# EAGLE design branches_v40 (EAGLE 9.6.2)
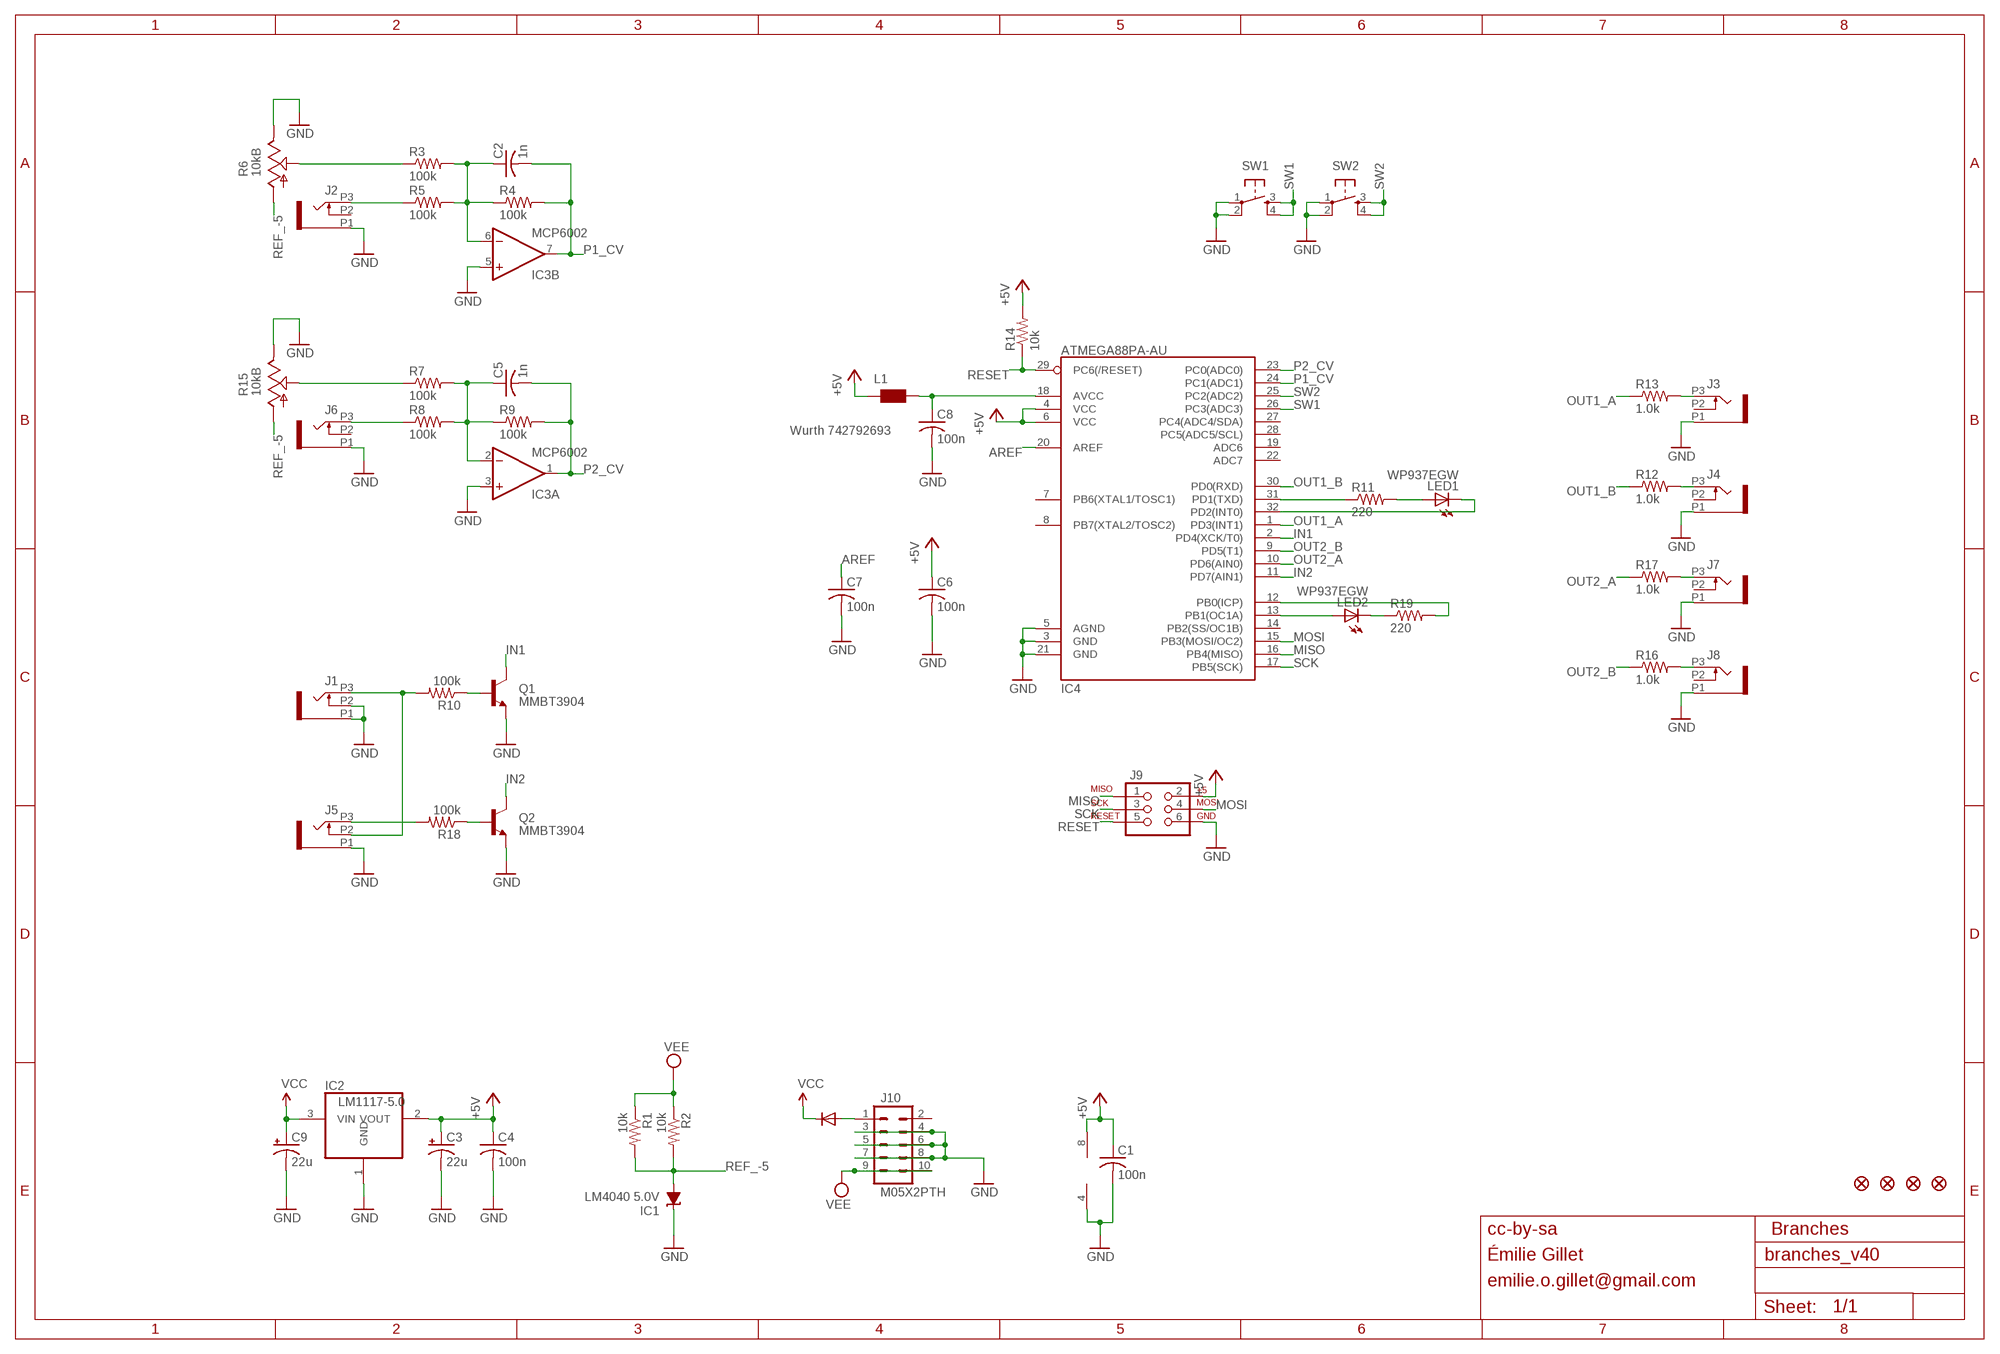
[diagram p0: schematic, sheet 1]

## Parts
C1  100n  C-USC0603  [C0603]
C2  1n  C-USC0603  [C0603]
C3  22u  CPOL-USC  [PANASONIC_C]
C4  100n  C-USC0603  [C0603]
C5  1n  C-USC0603  [C0603]
C6  100n  C-USC0603  [C0603]
C7  100n  C-USC0603  [C0603]
C8  100n  C-USC0603  [C0603]
C9  22u  CPOL-USC  [PANASONIC_C]
D1  1N5819HW  DIODE-SOD123  [SOD123]
F1  FIDUCIAL1X2  [FIDUCIAL-1X2]
F2  FIDUCIAL1X2  [FIDUCIAL-1X2]
F3  FIDUCIAL1X2  [FIDUCIAL-1X2]
F4  FIDUCIAL1X2  [FIDUCIAL-1X2]
IC1  LM4040 5.0V  LM4041C12DBZ  [DBZ_R-PDSO-G3]
IC2  LM1117-5.0  REG1117  [SOT223]
IC3  MCP6002  TL072D  [SO08]
IC4  ATMEGA88PA-AU  ATMEGA168  [TQFP32-08]
J1  PJ301_THONKICONN6  [WQP_PJ_301M6]
J2  PJ301_THONKICONN6  [WQP_PJ_301M6]
J3  PJ301_THONKICONN6  [WQP_PJ_301M6]
J4  PJ301_THONKICONN6  [WQP_PJ_301M6]
J5  PJ301_THONKICONN6  [WQP_PJ_301M6]
J6  PJ301_THONKICONN6  [WQP_PJ_301M6]
J7  PJ301_THONKICONN6  [WQP_PJ_301M6]
J8  PJ301_THONKICONN6  [WQP_PJ_301M6]
J9  AVR_SPI_PRG_6PTH  [2X3]
J10  M05X2PTH  [AVR_ICSP]
L1  WE-CBF_0603  [0603]
LED1  WP937EGW  LED3MM  [LED3MM]
LED2  WP937EGW  LED3MM  [LED3MM]
Q1  MMBT3904  MMBT3904LT1-NPN-SOT23-BEC  [SOT23-BEC]
Q2  MMBT3904  MMBT3904LT1-NPN-SOT23-BEC  [SOT23-BEC]
R1  10k  R-US_R0603  [R0603]
R2  10k  R-US_R0603  [R0603]
R3  100k  R-US_R0603  [R0603]
R4  100k  R-US_R0603  [R0603]
R5  100k  R-US_R0603  [R0603]
R6  10kB  POT_USVERTICAL_PS  [ALPS_POT_VERTICAL_PS]
R7  100k  R-US_R0603  [R0603]
R8  100k  R-US_R0603  [R0603]
R9  100k  R-US_R0603  [R0603]
R10  100k  R-US_R0603  [R0603]
R11  220  R-US_R0603  [R0603]
R12  1.0k  R-US_R0603  [R0603]
R13  1.0k  R-US_R0603  [R0603]
R14  10k  R-US_R0603  [R0603]
R15  10kB  POT_USVERTICAL_PS  [ALPS_POT_VERTICAL_PS]
R16  1.0k  R-US_R0603  [R0603]
R17  1.0k  R-US_R0603  [R0603]
R18  100k  R-US_R0603  [R0603]
R19  220  R-US_R0603  [R0603]
SW1  TAC_SWITCHPTH  [TACTILE-PTH]
SW2  TAC_SWITCHPTH  [TACTILE-PTH]

## Nets
+5V: C1.1 C3.+ C4.1 C6.1 IC2.2(VOUT) IC3.8(P:V+) IC4.4(VCC) IC4.6(VCC) J9.2 L1.1 R14.2
AREF: C7.1 IC4.20(AREF)
GATE1_IN: J1.P3 J5.P2 R10.2
GATE2_IN: J5.P3 R18.2
GND: C1.2 C3.- C4.2 C6.2 C7.2 C8.2 C9.- IC1.1(C) IC2.1(GND) IC3.3(A:+IN) IC3.4(P:V-) IC3.5(B:+IN) IC4.3(GND) IC4.5(AGND) IC4.21(GND) J1.P1 J1.P2 J2.P1 J3.P1 J4.P1 J5.P1 J6.P1 J7.P1 J8.P1 J9.6 J10.3 J10.4 J10.5 J10.6 J10.7 J10.8 Q1.E Q2.E R6.P$1(E) R15.P$1(E) SW1.1 SW1.2 SW2.1 SW2.2
IN1: IC4.2(PD4(XCK/T0)) Q1.C
IN2: IC4.11(PD7(AIN1)) Q2.C
MISO: IC4.16(PB4(MISO)) J9.1
MOSI: IC4.15(PB3(MOSI/OC2)) J9.4
N$1: Q1.B R10.1
N$2: Q2.B R18.1
N$3: D1.A J10.1
N$4: C5.1 IC3.2(A:-IN) R7.2 R8.2 R9.1
N$6: J8.P3 R16.2
N$8: R7.1 R15.P$2(S)
N$9: R3.1 R6.P$2(S)
N$10: J2.P3 R5.1
N$11: J6.P3 R8.1
N$13: IC4.31(PD1(TXD)) R11.1
N$14: LED1.A R11.2
N$15: IC4.32(PD2(INT0)) LED1.K(C)
N$16: IC4.13(PB1(OC1A)) LED2.A
N$17: LED2.K(C) R19.1
N$18: IC4.12(PB0(ICP)) R19.2
N$29: C2.1 IC3.6(B:-IN) R3.2 R4.1 R5.2
N$34: J3.P3 R13.2
N$35: J4.P3 R12.2
N$36: J7.P3 R17.2
N$39: C8.1 IC4.18(AVCC) L1.2
OUT1_A: IC4.1(PD3(INT1)) R13.1
OUT1_B: IC4.30(PD0(RXD)) R12.1
OUT2_A: IC4.10(PD6(AIN0)) R17.1
OUT2_B: IC4.9(PD5(T1)) R16.1
P1_CV: C2.2 IC3.7(B:OUT) IC4.24(PC1(ADC1)) R4.2
P2_CV: C5.2 IC3.1(A:OUT) IC4.23(PC0(ADC0)) R9.2
REF_-5: IC1.2(A) R1.2 R2.2 R6.P$3(A) R15.P$3(A)
RESET: IC4.29(PC6(/RESET)) J9.5 R14.1
SCK: IC4.17(PB5(SCK)) J9.3
SW1: IC4.26(PC3(ADC3)) SW1.3 SW1.4
SW2: IC4.25(PC2(ADC2)) SW2.3 SW2.4
VCC: C9.+ D1.C IC2.3(VIN)
VEE: J10.9 J10.10 R1.1 R2.1
Unconnected: IC4.7(PB6(XTAL1/TOSC1)) IC4.8(PB7(XTAL2/TOSC2)) IC4.14(PB2(SS/OC1B)) IC4.19(ADC6) IC4.22(ADC7) IC4.27(PC4(ADC4/SDA)) IC4.28(PC5(ADC5/SCL)) J2.P2 J3.P2 J4.P2 J6.P2 J7.P2 J8.P2 J10.2

## Notes on the sheet
- Wurth 742792693
- cc-by-sa | Branches
- Émilie Gillet
- emilie.o.gillet@gmail.com

## Library data of the parts
C1 C2 C4-C8 = rcl:C-US: CAPACITOR, American symbol
C3 C9 = rcl:CPOL-US: POLARIZED CAPACITOR, American symbol
D1 = diode:DIODE-: DIODE
F1-F4 = SparkFun:FIDUCIAL: Fiducial Alignment Points Various fiducial points for machine vision alignment.
IC1 = texas:LM4041: PRECISION MICROPOWER SHUNT VOLTAGE REFERENCE Source: http://focus.ti.com/lit/ds/slcs146e/slcs146e.pdf
IC2 = og-vreg:REG1117: 800mA and 1A Low Dropout (LDO) Positive Regulator 1.8V, 2.5V, 2.85V, 3.3V, 5V, and Adj
IC3 = og-linear:TL072: OP AMP
IC4 = SparkFun:ATMEGA168
J1-J8 = og-pj301:PJ301_THONKICONN
J9 = SparkFun:AVR_SPI_PRG_6: AVR ISP 6 Pin This is the reduced ISP connector for AVR programming. Common on Arduino. This footprint will take up less PCB space and can be used with a 10-pin to 6-pin adapter such as SKU: BOB-08508
J10 = og-header:M05X2: Header 5x2 Standard 10-pin dual row 0.1" header. Commonly used with AVR-ISP. Use with Spark Fun Electronics SKU: PRT-00778
L1 = wuerth-elektronik:WE-CBF: SMD EMI Suppression Ferrite Beads - excellent anti-EMI properties - low DCR - impedances till 3000 ohms - rated current up to 6 A
LED1 LED2 = led:LED: LED OSRAM: - CHIPLED LG R971, LG N971, LY N971, LG Q971, LY Q971, LO R971, LY R971 LH N974, LH R974 LS Q976, LO Q976, LY Q976 LO Q996 - Hyper CHIPLED LW Q18S LB Q993, LB Q99A, LB R99A - SideLED LS A670, LO A670, LY A670, LG A670, LP A670 LB A673, LV A673, LT A673, LW A673 LH A674 LY A675 LS A676, LA A676, LO A676, LY A676, LW A676 LS A679, LY A679, LG A679 - Hyper Micro SIDELED® LS Y876, LA Y876, LO Y876, LY Y876 LT Y87S - SmartLED LW L88C, LW L88S LB L89C, LB L89S, LG L890 LS L89K, LO L89K, LY L89K LS L896, LA L896, LO L896, LY L896 - TOPLED LS T670, LO T670, LY T670, LG T670, LP T670 LSG T670, LSP T670, LSY T670, LOP T670, LYG T670 LG T671, LOG T671, LSG T671 LB T673, LV T673, LT T673, LW T673 LH T674 LS T676, LA T676, LO T676, LY T676, LB T676, LH T676, LSB T676, LW T676 LB T67C, LV T67C, LT T67C, LS T67K, LO T67K, LY T67K, LW E67C LS E67B, LA E67B, LO E67B, LY E67B, LB E67C, LV E67C, LT E67C LW T67C LS T679, LY T679, LG T679 LS T770, LO T770, LY T770, LG T770, LP T770 LB T773, LV T773, LT T773, LW T773 LH T774 LS E675, LA E675, LY E675, LS T675 LS T776, LA T776, LO T776, LY T776, LB T776 LHGB T686 LT T68C, LB T68C - Hyper Mini TOPLED® LB M676 - Mini TOPLED Santana® LG M470 LS M47K, LO M47K, LY M47K Source: http://www.osram.convergy.de LUXEON: - LUMILED® LXK2-PW12-R00, LXK2-PW12-S00, LXK2-PW14-U00, LXK2-PW14-V00 LXK2-PM12-R00, LXK2-PM12-S00, LXK2-PM14-U00 LXK2-PE12-Q00, LXK2-PE12-R00, LXK2-PE12-S00, LXK2-PE14-T00, LXK2-PE14-U00 LXK2-PB12-K00, LXK2-PB12-L00, LXK2-PB12-M00, LXK2-PB14-N00, LXK2-PB14-P00, LXK2-PB14-Q00 LXK2-PR12-L00, LXK2-PR12-M00, LXK2-PR14-Q00, LXK2-PR14-R00 LXK2-PD12-Q00, LXK2-PD12-R00, LXK2-PD12-S00 LXK2-PH12-R00, LXK2-PH12-S00 LXK2-PL12-P00, LXK2-PL12-Q00, LXK2-PL12-R00 Source: www.luxeon.com KINGBRIGHT: KA-3528ASYC Source: www.kingbright.com
Q1 Q2 = transistor:*-NPN-: NPN Transistror BF959 corrected 2008.03.06
R1 R2 = resistor:R-US_: RESISTOR, American symbol
R3-R5 R7-R14 R16-R19 = rcl:R-US_: RESISTOR, American symbol
R6 R15 = pot-alps:POT_US
SW1 SW2 = SparkFun:TAC_SWITCH: Momentary Switch Button commonly used for reset or general input. Spark Fun Electronics SKU : COM-00097

## Board
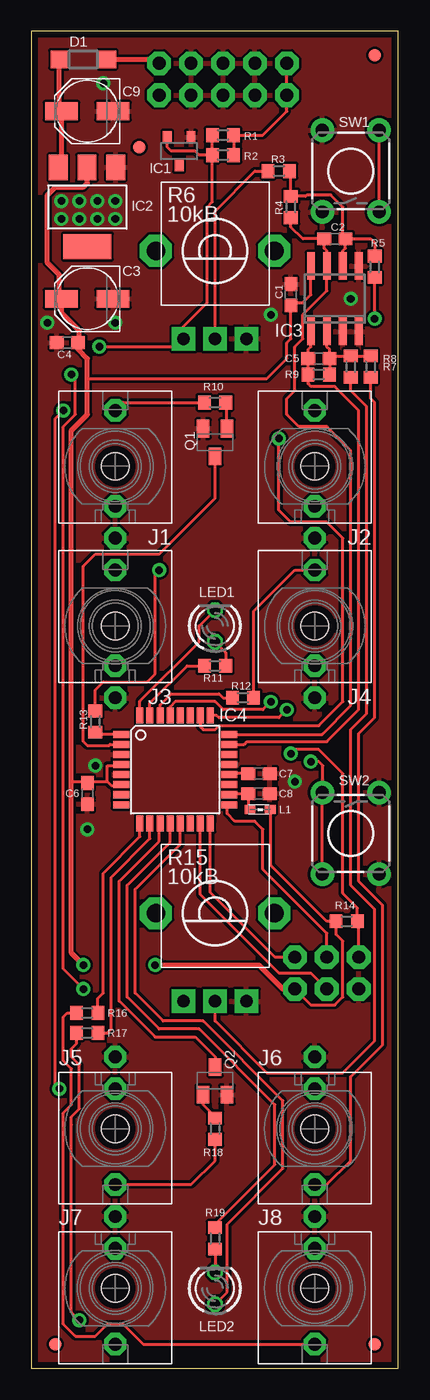
[diagram p1: board, top side]
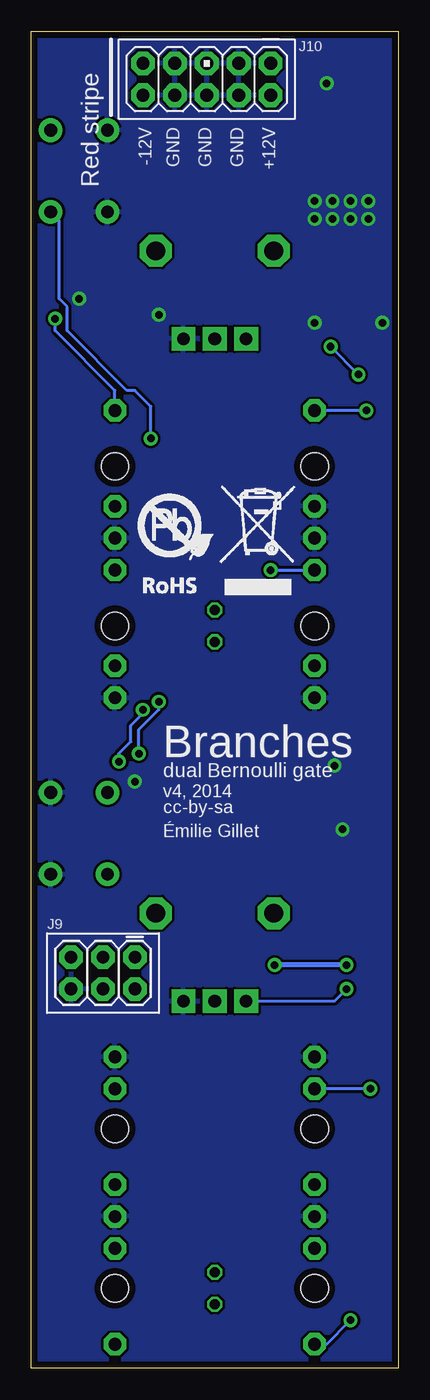
[diagram p2: board, bottom side, seen from below]

Size 29.19 x 106.36 mm. Coordinates in mm from the lower left corner, seen from the top.
Outline: 0,0 29.19,0 29.19,106.36 0,106.36 0,0
Copper layers (1*16): Top 0.035mm / dielectric 1.5mm / Bottom 0.035mm
Design rules "PCBCart-Standard *": minimum track width 8mil, minimum drill 0.4mm, track to track 8mil, track to pad 8mil, pad to pad 8mil, via to via 8mil, smd to smd 8mil, copper to edge 20mil, drill to drill 8mil, minimum pad ring 8mil, minimum via ring 10mil, stop-mask expansion 3mil, vias tented up to drill 25mil, thermal gap 8mil

### Footprints (pad centres in the part's own frame; a part is rotated, then mirrored left to right if it is on the bottom)
C0603 = smd 1.1 x 1: 1 -0.85,0; 2 0.85,0
PANASONIC_C = smd 2.6 x 1.4: + 2.05,0; - -2.05,0
SOD123 = smd 1.4 x 1.4: A 1.9,0; C -1.9,0
FIDUCIAL-1X2 = smd 1 x 1: 1 0,0
DBZ_R-PDSO-G3 = smd 0.7 x 1: 1 -0.95,-1.1; 2 0.95,-1.1; 3 0,1.1
SOT223 = smd 1.499 x 2.007: 1 -2.261,-3.15; 2 0.025,-3.15; 3 2.311,-3.15 | smd 3.81 x 2.007: 4 0,3.15
SO08 = smd 0.6 x 2.2: 1 -1.905,-2.6; 2 -0.635,-2.6; 3 0.635,-2.6; 4 1.905,-2.6; 5 1.905,2.6; 6 0.635,2.6; 7 -0.635,2.6; 8 -1.905,2.6
TQFP32-08 = smd 1.27 x 0.559: 1 -4.293,2.8; 2 -4.293,2; 3 -4.293,1.2; 4 -4.293,0.4; 5 -4.293,-0.4; 6 -4.293,-1.2; 7 -4.293,-2; 8 -4.293,-2.8; 17 4.293,-2.8; 18 4.293,-2; 19 4.293,-1.2; 20 4.293,-0.4; 21 4.293,0.4; 22 4.293,1.2; 23 4.293,2; 24 4.293,2.8 | smd 0.559 x 1.27: 9 -2.8,-4.293; 10 -2,-4.293; 11 -1.2,-4.293; 12 -0.4,-4.293; 13 0.4,-4.293; 14 1.2,-4.293; 15 2,-4.293; 16 2.8,-4.293; 25 2.8,4.293; 26 2,4.293; 27 1.2,4.293; 28 0.4,4.293; 29 -0.4,4.293; 30 -1.2,4.293; 31 -2,4.293; 32 -2.8,4.293
WQP_PJ_301M6 = drill 1.016 pad 1.778 octagon: P1 0,-5.715; P2 0,-3.175; P3 0,4.445 | hole 2.2: 0,0
2X3 = drill 1.016 pad 1.88 octagon: 1 0,0; 2 0,2.54; 3 2.54,0; 4 2.54,2.54; 5 5.08,0; 6 5.08,2.54
AVR_ICSP = drill 1.016 pad 1.88 octagon: 1 -1.27,5.08; 2 1.27,5.08; 3 -1.27,2.54; 4 1.27,2.54; 5 -1.27,0; 6 1.27,0; 7 -1.27,-2.54; 8 1.27,-2.54; 9 -1.27,-5.08; 10 1.27,-5.08
0603 = smd 0.85 x 0.7: 1 -0.9,0; 2 0.7,0
LED3MM = drill 0.813 octagon: A -1.27,0; K 1.27,0
SOT23-BEC = smd 1 x 1.4: B -0.95,-1.1; C 0,1.1; E 0.95,-1.1
R0603 = smd 1 x 1.1: 1 -0.85,0; 2 0.85,0
ALPS_POT_VERTICAL_PS = drill 1 pad 1.88 square: P$1 -2.5,7; P$2 0,7; P$3 2.5,7 | drill 1.5 pad 2.54 octagon: P$4 -4.7,0; P$5 4.7,0
TACTILE-PTH = drill 1.016 pad 1.88: 1 -3.251,2.261; 2 3.251,2.261; 3 -3.251,-2.261; 4 3.251,-2.261

### Placement (x,y rotation side)
C1  20.64,85.41 90 top
C2  24.13,89.85 180 top
C3  4.45,85.09 180 top
C4  2.86,81.6 180 top
C5  22.86,80.33 180 top
C6  4.45,45.72 270 top
C7  18.1,47.31 0 top
C8  18.1,45.72 0 top
C9  4.45,100.01 180 top
D1  4.13,104.14 0 top
F1  27.3,104.46 90 top
F2  8.57,97.16 90 top
F3  1.91,1.91 90 top
F4  27.3,1.91 90 top
IC1  11.75,96.84 180 top
IC2  4.45,92.39 180 top
IC3  24.13,85.09 0 top
IC4  11.43,47.62 0 top
J1  6.67,71.75 0 top
J2  22.54,71.75 0 top
J3  6.67,59.05 0 top
J4  22.54,59.05 0 top
J5  6.67,19.05 180 top
J6  22.54,19.05 180 top
J7  6.67,6.35 180 top
J8  22.54,6.35 180 top
J9  20.95,32.7 180 bottom
J10  15.24,102.55 270 bottom
L1  18.1,44.45 180 top
LED1  14.61,59.05 90 top
LED2  14.61,6.35 90 top
Q1  14.61,73.66 180 top
Q2  14.61,22.86 0 top
R1  15.24,98.11 180 top
R2  15.24,96.52 180 top
R3  19.68,95.25 0 top
R4  20.64,92.39 270 top
R5  27.3,87.63 90 top
R6  14.61,88.9 180 top
R7  25.4,79.69 90 top
R8  26.99,79.69 90 top
R9  22.86,79.06 180 top
R10  14.61,76.83 180 top
R11  14.61,55.88 0 top
R12  16.83,53.34 0 top
R13  5.08,51.44 90 top
R14  25.08,35.56 180 top
R15  14.61,36.2 180 top
R16  4.45,28.26 180 top
R17  4.45,26.67 180 top
R18  14.61,19.05 270 top
R19  14.61,10.32 90 top
SW1  25.4,95.25 90 top
SW2  25.4,42.55 270 top
U$1  [ROHS]  21.59,60.96 0 bottom

### Tracks (layer width: path | path; a pad name or v marks a point on that pad's centre or on a via)
+5V  (via drill 0.6)
  Top 0.254: IC4.4 7.05,47.94 6.03,47.94 6.03,46.67 | IC4.6 7.07,46.35 6.35,46.35 6.03,46.67 | 4.55,46.67 C6.1 | 3.17,46.67 4.55,46.67 | L1.1 19.05,44.4 19.05,40.01 23.5,35.56 R14.2 24.23,34.51 24.77,33.97 24.77,29.53 24.13,28.89 22.23,28.89 J9.2 | 4.45,78.74 18.73,78.74 20.32,80.33 20.32,81.6 20.64,81.92 C1.1 20.85,84.77 21.59,84.77 22.23,85.41 IC3.8 | 4.55,46.67 6.03,46.67
  Top 0.406: IC2.2 4.45,95.52 4.45,94.3 4.13,93.98 1.91,93.98 1.27,93.34 1.27,87.95 2.22,87 2.22,85.26 C3.+ | C3.+ 2.33,85.02 | v4.13,32.07 3.17,33.02 3.17,46.67 3.17,74.61 4.45,75.88 4.45,78.74 4.45,80.33 3.71,81.06 C4.1 3.81,81.7 3.81,82.55 2.4,83.97 C3.+ | v9.84,32.07 18.1,32.07 20,30.16 J9.2
  Bottom 0.406: v4.13,32.07 v9.84,32.07
AREF
  Top 0.254: IC4.20 15.8,47.31 C7.1
GATE1_IN  (via drill 0.6)
  Top 0.254: J1.P3 7.3,76.83 R10.2 | v2.54,76.2 1.91,75.56 1.91,22.54 v2.22,22.23
  Bottom 0.254: v2.54,76.2 J1.P3 | v2.22,22.23 J5.P2
GATE2_IN
  Top 0.254: 14.5,18.2 R18.2 14.61,16.51 12.7,14.61 J5.P3
GND  (via drill 0.6)
  other vias: 20.95,46.67 4.45,42.86 6.67,83.19 2.38,92.87 3.81,92.87 5.24,92.87 6.67,92.87 2.38,91.44 3.81,91.44 5.24,91.44 6.67,91.44 25.4,85.09 1.27,83.19 19.05,83.82 5.08,47.94 5.71,102.23
  pour Bottom: 0,106.36 0,0 29.21,0 29.21,106.36
  pour Top: 0,106.36 0,0 29.21,0 29.21,106.36
IN1
  Top 0.254: Q1.C 14.61,69.22 10.16,64.77 5.08,64.77 4.13,63.82 4.13,49.85 4.45,49.53 6.16,49.53 6.25,49.62 IC4.2
IN2
  Top 0.254: IC4.11 10.16,43.26 10.16,41.91 6.99,38.73 6.99,29.21 9.84,26.35 13.02,26.35 14.61,24.77 Q2.C
MISO
  Top 0.254: 14.39,43.5 IC4.16 14.23,37.84 19.37,32.7 J9.1
MOSI
  Top 0.254: 13.34,43.24 IC4.15 13.43,37.69 19.68,31.43 22.23,31.43 J9.4
N$1
  Top 0.254: R10.1 15.55,76.73 Q1.B
N$2
  Top 0.254: Q2.B 13.65,20.95 14.61,20 R18.1
N$3
  Top 0.406: J10.1 9.84,104.14 D1.A
N$4
  Top 0.254: C5.1 R9.1 | C5.1 23.93,80.54 R7.2 R8.2 | IC3.2 23.5,81.28 23.71,81.06 C5.1
N$6
  Top 0.254: R16.2 2.86,28.26 2.54,27.94 2.54,24.45 3.17,23.81 3.17,20.95 2.54,20.32 2.54,3.49 3.49,2.54 5.08,2.54 6.03,3.49 7.3,3.49 8.89,1.91 J8.P3
N$8
  Top 0.254: R15.P$2 14.61,27.62 18.73,23.5 24.77,23.5 27.3,26.04 27.3,36.51 25.4,38.42 25.4,50.8 26.67,52.07 26.67,76.52 25.4,77.79 R7.1
N$9
  Top 0.254: R6.P$2 14.61,92.08 17.78,95.25 R3.1
N$10  (via drill 0.6)
  Top 0.254: v27.3,83.5 R5.1
  Bottom 0.254: v27.3,83.5 27.3,82.55 22.54,77.79 J2.P3
N$11
  Top 0.254: J6.P3 23.5,14.61 25.4,16.51 25.4,23.18 27.94,25.72 27.94,36.83 26.04,38.73 26.04,50.48 27.3,51.75 27.3,76.83 26.99,77.15 R8.1
N$13
  Top 0.254: R11.1 12.38,55.88 9.43,52.93 IC4.31
N$14
  Top 0.254: LED1.A 15.46,56.94 R11.2
N$15
  Top 0.254: LED1.K 13.34,59.05 13.34,57.78 8.63,53.08 IC4.32
N$16
  Top 0.254: LED2.A 15.56,6.03 15.56,11.43 20,15.88 20,21.27 13.65,27.62 10.48,27.62 8.26,29.84 8.26,38.1 11.83,41.67 IC4.13
N$17
  Top 0.254: R19.1 LED2.K
N$18
  Top 0.254: R19.2 14.61,11.43 19.37,16.19 19.37,20.95 13.34,26.99 10.16,26.99 7.62,29.53 7.62,38.42 11.03,41.83 IC4.12
N$29
  Top 0.254: IC3.6 24.77,88.9 24.98,89.11 C2.1 | R5.2 27.3,89.53 26.99,89.85 C2.1 | C2.1 24.77,90.07 24.77,92.39 23.81,93.34 21.91,93.34 21.8,93.24 R4.1 20.64,95.15 R3.2
N$34  (via drill 0.6)
  Top 0.254: v10.16,63.5 9.84,63.18 9.84,55.24 9.21,54.61 5.71,54.61 5.08,53.98 R13.2
  Bottom 0.254: v10.16,63.5 J3.P3
N$35
  Top 0.254: J4.P3 20.95,63.5 17.68,60.22 R12.2
N$36  (via drill 0.6)
  Top 0.254: 3.81,26.45 R17.2 3.6,25.82 3.17,25.4 3.17,24.77 3.81,24.13 3.81,20.64 3.17,20 3.17,19.37 3.17,4.45 v3.81,3.81
  Bottom 0.254: v3.81,3.81 5.71,1.91 J7.P3
N$39
  Top 0.254: L1.2 17.25,44.6 C8.1 15.82,45.72 IC4.18
OUT1_A
  Top 0.254: 6.99,50.58 IC4.1 5.24,50.42 R13.1
OUT1_B
  Top 0.254: IC4.30 10.23,52.77 11.11,53.66 14.92,53.66 15.24,53.34 R12.1
OUT2_A
  Top 0.254: IC4.10 9.43,42.13 6.35,39.05 6.35,26.99 6.03,26.67 R17.1
OUT2_B
  Top 0.254: IC4.9 8.63,42.28 5.71,39.37 5.71,29.84 5.29,29.43 R16.1
P1_CV
  Top 0.254: IC4.24 23.12,50.42 25.4,52.7 25.4,73.03 23.5,74.93 21.27,74.93 20.32,75.88 20.32,77.15 20.95,77.79 20.95,81.28 21.59,81.92 21.59,83.82 23.5,85.72 IC3.7 23.5,88.9 23.28,89.11 C2.2 21.59,89.85 20.64,90.81 R4.2
P2_CV
  Top 0.254: IC4.23 16.92,49.62 17.14,49.85 23.5,49.85 26.04,52.39 26.04,76.2 24.13,78.11 22.23,78.11 22.01,78.32 R9.2 C5.2 22.01,81.06 22.23,81.28 IC3.1
REF_-5  (via drill 0.6)
  Top 0.254: 12.06,81.94 R6.P$3 | 12.06,81.94 12.06,82.87 13.97,84.77 13.97,92.39 14.39,92.81 R2.2 | v3.17,79.06 3.49,78.74 3.49,75.88 2.54,74.93 2.54,31.75 v4.13,30.16 | R2.2 R1.2 | IC1.2 10.79,97.16 11.11,96.84 13.02,96.84 13.34,96.52 R2.2 | 12.06,81.94 11.4,81.28 v5.4,81.28
  Bottom 0.254: R6.P$3 12.09,81.92 | v3.17,79.06 v5.4,81.28 | v4.13,30.16 5.09,29.2 R15.P$3
RESET  (via drill 0.6)
  Top 0.254: IC4.29 11.03,52.62 11.43,53.02 14.61,53.02 15.24,52.39 18.41,52.39 v19.05,53.02 | J9.5 26.04,35.46 R14.1 25.93,36.62 24.77,37.78 24.77,47.31 22.86,49.21 20.95,49.21 v20.64,48.9
  Bottom 0.254: v19.05,53.02 19.05,52.39 20.64,50.8 v20.64,48.9
SCK
  Top 0.254: IC4.17 15.56,44.66 15.56,44.13 16.19,43.5 17.78,43.5 18.41,42.86 18.41,39.69 23.5,34.61 J9.3
SW1  (via drill 0.6)
  Top 0.254: SW1.3 SW1.4 | 13.34,51.82 IC4.26 13.43,51.02 13.65,50.8 14.61,50.8 14.92,51.12 22.86,51.12 24.77,53.02 24.77,66.04 23.5,67.31 20.64,67.31 19.68,68.26 v19.68,73.98
  Bottom 0.254: SW1.3 26.99,91.33 26.99,85.09 26.35,84.45 26.35,82.55 21.59,77.79 20.95,77.79 19.68,76.52 v19.68,73.98
SW2  (via drill 0.6)
  Top 0.254: SW2.4 SW2.3 23.18,45.83 23.18,47.94 22.86,48.26 v22.23,48.26 | v20.32,52.39 19.68,51.75 14.92,51.75 14.76,51.92 IC4.25
  Bottom 0.254: v20.32,52.39 20.32,52.07 21.27,51.12 21.27,49.85 22.23,48.9 v22.23,48.26
VCC
  Top 0.406: 2.45,103.92 D1.C 2.23,100.18 C9.+ 2.4,95.8 IC2.3
VEE
  Top 0.254: J10.9 J10.10 20.32,100.01 18.41,98.11 R1.1 R2.1

### Text on the board
bPlace: Red stripe
bNames: +12V | GND | GND | GND | -12V | Branches | dual Bernoulli gate | v4, 2014 | cc-by-sa | Émilie Gillet